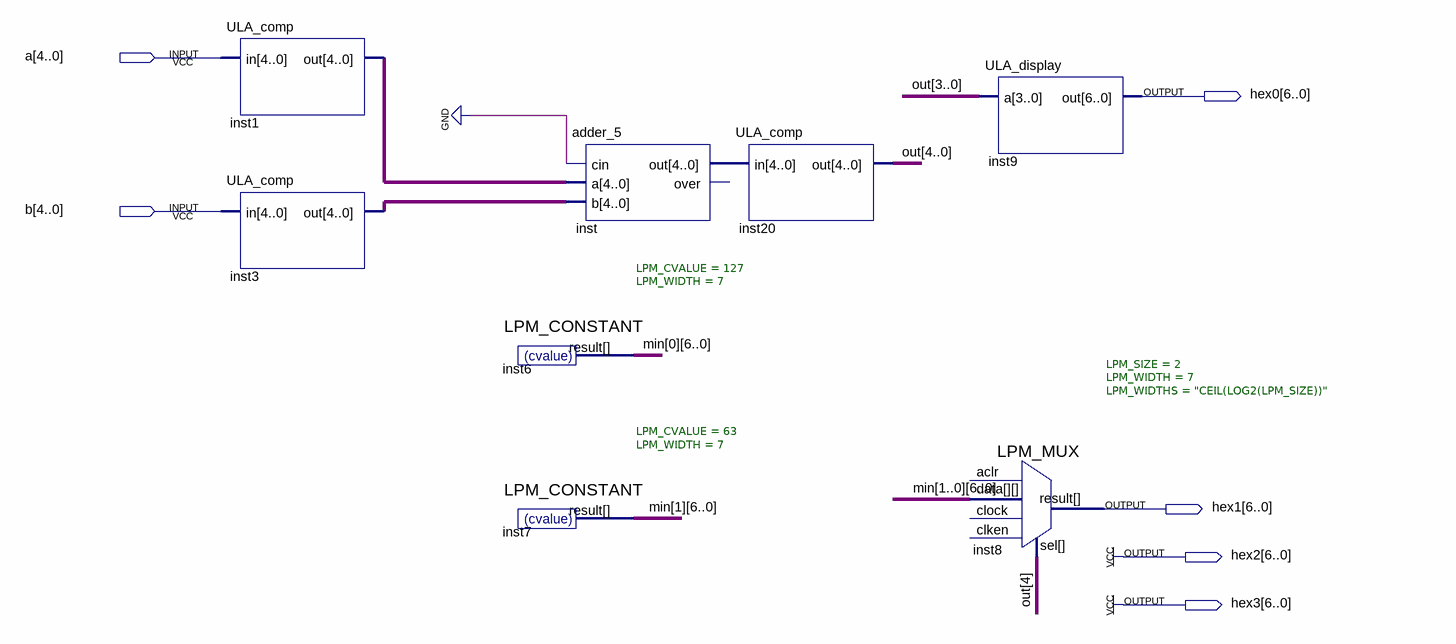
[diagram p0: schematic sheet]
// Quartus schematic ULA_adder.bdf as structural Verilog: 8 symbols, 6 pins
module ULA_adder (
  input  [4:0] a,
  input  [4:0] b,
  output [6:0] hex0,
  output [6:0] hex1,
  output [6:0] hex2,
  output [6:0] hex3
);

  wire [4:0] inst1_out, inst3_out, inst_out, out;
  wire [6:0] min_0, min_1;

  ULA_comp inst1 (.in(a), .out(inst1_out));
  ULA_comp inst3 (.in(b), .out(inst3_out));
  LPM_CONSTANT #(.LPM_CVALUE(127), .LPM_WIDTH(7)) inst6 (.result(min_0));
  LPM_CONSTANT #(.LPM_CVALUE(63), .LPM_WIDTH(7)) inst7 (.result(min_1));
  adder_5 inst (.cin(1'b0), .a(inst1_out), .b(inst3_out), .out(inst_out));  // open: over
  ULA_comp inst20 (.in(inst_out), .out(out));
  ULA_display inst9 (.a(out[3:0]), .out(hex0));
  LPM_MUX #(.LPM_SIZE(2), .LPM_WIDTH(7), .LPM_WIDTHS("CEIL(LOG2(LPM_SIZE))")) inst8 (
    .data({min_1, min_0}), .sel(out[4]), .result(hex1));  // open: clock, aclr, clken

  assign hex2 = {7{1'b1}};
  assign hex3 = {7{1'b1}};
endmodule
